# EAGLE design Printer Power (EAGLE 7.6.0)
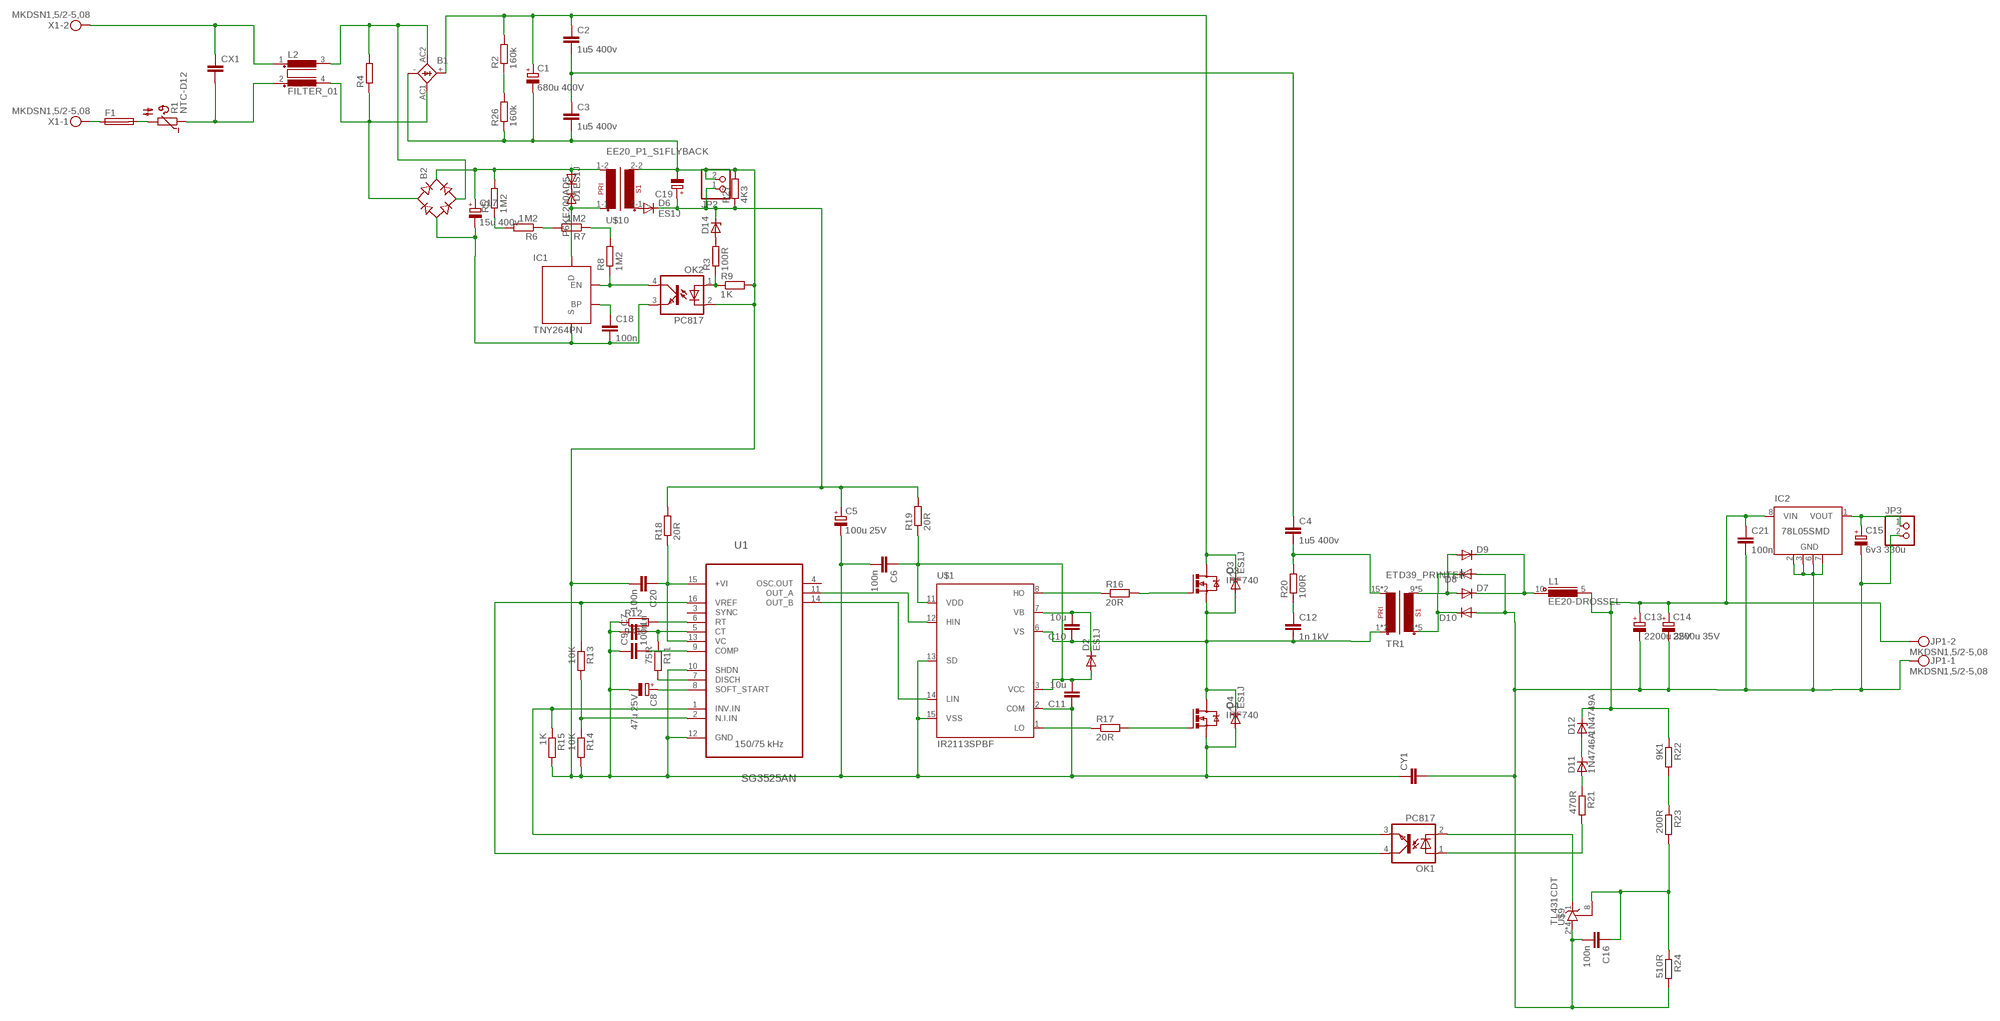
[diagram p0: schematic, sheet 1]

## Parts
B1  KBL  [KBL]
B2  RB1A  [RB1A]
C1  680u 400V  CPOL-EUE10-35  [EB35D]
C2  1u5 400v  C-EU225-074X268  [C225-074X268]
C3  1u5 400v  C-EU225-074X268  [C225-074X268]
C4  1u5 400v  C-EU225-074X268  [C225-074X268]
C5  100u 25V  CPOL-EUE2.5-7  [E2,5-7]
C6  100n  C-EUC0805  [C0805]
C7  1n  C-EUC0805  [C0805]
C8  47u 25V  CPOL-EUE2.5-7  [E2,5-7]
C9  100n  C-EUC0805  [C0805]
C10  10u  C-EUC0805  [C0805]
C11  10u  C-EUC0805  [C0805]
C12  1n 1kV  C-EU050-025X075  [C050-025X075]
C13  2200u 35V  CPOL-EUE7.5-18  [E7,5-18]
C14  2200u 35V  CPOL-EUE7.5-18  [E7,5-18]
C15  6v3 330u  CPOL-EUE2.5-7  [E2,5-7]
C16  100n  C-EUC0805  [C0805]
C17  15u 400v  CPOL-EUE5-13  [E5-13]
C18  100n  C-EUC0805  [C0805]
C19  CPOL-EUE2.5-7  [E2,5-7]
C20  100n  C-EUC0805  [C0805]
C21  100n  C-EUC0805  [C0805]
CX1  CXXC15B8  [XC15B8]
CY1  CYYC10B4  [YC10B4]
D1  P6KE200A  DIODE-DO204-10  [DO204-10]
D2  ES1J  DIODE-DO214AC  [DO214AC]
D3  ES1J  DIODE-DO214AC  [DO214AC]
D4  ES1J  DIODE-DO214AC  [DO214AC]
D5  ES1J  DIODE-DO214AC  [DO214AC]
D6  ES1J  DIODE-DO214AC  [DO214AC]
D7  DIODE-DO220S  [DO220S]
D8  DIODE-DO220S  [DO220S]
D9  DIODE-DO220S  [DO220S]
D10  DIODE-DO220S  [DO220S]
D11  1N4746A  ZENER-DIODEDO41Z10  [DO41Z10]
D12  1N4749A  ZENER-DIODEDO41Z10  [DO41Z10]
D14  ZENER-DIODEDO41Z10  [DO41Z10]
F1  SH22,5  [SH22,5]
IC1  TNY264PN  [DIP-8B]
IC2  78L05SMD  [SO08]
JP1  MKDSN1,5/2-5,08  [MKDSN1,5/2-5,08]
JP2  PINHD-1X2  [1X02]
JP3  PINHD-1X2  [1X02]
L1  EE20-DROSSEL  [EE20_DROSSEL]
L2  FILTER_01  [82721K]
OK1  PC817  [DIL04]
OK2  PC817  [DIL04]
Q3  IRF740  [TO220BV]
Q4  IRF740  [TO220BV]
R1  NTC-D12  [NTC-D12]
R2  160k  R-EU_0207/10  [0207/10]
R3  100R  R-EU_R0805  [R0805]
R4  R-EU_0309/10  [0309/10]
R5  1M2  R-EU_R0805  [R0805]
R6  1M2  R-EU_R0805  [R0805]
R7  1M2  R-EU_R0805  [R0805]
R8  1M2  R-EU_R0805  [R0805]
R9  1K  R-EU_R0805  [R0805]
R11  75R  R-EU_R0805  [R0805]
R12  9K1  R-EU_R0805  [R0805]
R13  10K  R-EU_R0805  [R0805]
R14  10K  R-EU_R0805  [R0805]
R15  1K  R-EU_R0805  [R0805]
R16  20R  R-EU_0309/12  [0309/12]
R17  20R  R-EU_0309/12  [0309/12]
R18  20R  R-EU_R2512  [R2512]
R19  20R  R-EU_R2512  [R2512]
R20  100R  R-EU_0617/17  [0617/17]
R21  470R  R-EU_R0805  [R0805]
R22  9K1  R-EU_R0805  [R0805]
R23  200R  R-EU_R0805  [R0805]
R24  510R  R-EU_R0805  [R0805]
R26  160k  R-EU_0207/10  [0207/10]
R27  4K3  R-EU_R0805  [R0805]
TR1  ETD39_PRINTER  [ETD39_16PIN]
U1  SG3525AN  [DIP254P762X510-16]
U$1  IR2113SPBF  [SO16W]
U$9  TL431CDT  [SO8]
U$10  EE20_P1_S1FLYBACK  [EE20_P1_S1-REV-4PIN]
X1  MKDSN1,5/2-5,08  [MKDSN1,5/2-5,08]

## Nets
HV-0: B1.- C1.- C3.2 C5.- C6.2 C7.1 C8.- C9.1 C11.1 C19.- C20.2 CY1.1 D4.A JP2.2 OK2.2(C) Q4.S R9.2 R12.1 R14.2 R15.2 R26.1 R27.2 U1.10(SHDN) U1.12(GND) U$1.2(COM) U$1.13(SD) U$1.15(VSS) U$10.2-2(S1-2)
HV-150: C2.2 C3.1 C4.1
HV-300: B1.+ C1.+ C2.1 D3.C Q3.D R2.2
N$1: F1.1 X1.1
N$2: F1.2 R1.2
N$3: CX1.2 L2.2 R1.1
N$4: D7.C D9.C L1.10
N$5: R16.1 U$1.8(HO)
N$6: R17.1 U$1.1(LO)
N$7: Q3.G R16.2
N$8: OK1.3(EMIT) R15.1 U1.1(INV.IN)
N$9: C4.2 R20.2 TR1.15(P1-2) TR1.16(P1-2)
N$10: C20.1 R18.1 U1.13(VC) U1.15(+VI)
N$11: B1.AC1(AC2) B2.AC1 L2.4 R4.1
N$12: CX1.1 L2.1 X1.2
N$13: B2.- C17.- C18.2 IC1.2(S) IC1.3(S) IC1.7(S) IC1.8(S) OK2.3(EMIT)
N$14: B1.AC2(AC1) B2.AC2 L2.3 R4.2
N$15: C7.2 R11.1 U1.5(CT)
N$16: R11.2 U1.7(DISCH)
N$17: Q4.G R17.2
N$18: U1.11(OUT_A) U$1.12(HIN)
N$19: U1.14(OUT_B) U$1.14(LIN)
N$20: R12.2 U1.6(RT)
N$21: C8.+ U1.8(SOFT_START)
N$22: C9.2 U1.9(COMP)
N$23: OK1.4(COL) R13.1 U1.16(VREF)
N$24: R13.2 R14.1 U1.2(N.I.IN)
N$25: IC1.4(EN) OK2.4(COL) R8.1
N$26: C13.- C14.- C15.- C16.2 C21.2 CY1.2 D8.A D10.A IC2.2(GND) IC2.3(GND) IC2.6(GND) IC2.7(GND) JP1.1 JP3.2 R24.2 U$9.2(A) U$9.3(A) U$9.6(A) U$9.7(A)
N$27: D8.C D10.C TR1.4(S1-1) TR1.5(S1-1) TR1.6(S1-1) TR1.7(S1-1) TR1.8(S1-1)
N$28: R5.1 R6.2
N$29: R6.1 R7.2
N$30: C12.1 R20.1
N$31: D7.A D9.A TR1.9(S1-2) TR1.10(S1-2) TR1.11(S1-2) TR1.12(S1-2) TR1.13(S1-2)
N$32: C15.+ IC2.1(VOUT) JP3.1
N$36: C13.+ C14.+ C21.1 D12.C IC2.8(VIN) JP1.2 L1.5 R22.1
N$37: D11.C D12.A
N$38: D11.A R21.1
N$39: OK1.1(A) R21.2
N$40: OK1.2(C) U$9.1(C)
N$41: C16.1 R23.2 R24.1 U$9.8(R)
N$42: R22.2 R23.1
N$44: R2.1 R26.2
N$46: C5.+ C19.+ D6.C D14.C JP2.1 R18.2 R19.2 R27.1
N$47: R7.1 R8.2
N$48: D1.C D5.C
N$49: D5.A IC1.5(D) U$10.1-1
N$50: D14.A R3.2
N$51: C18.1 IC1.1(BP)
N$52: B2.+ C17.+ D1.A R5.2 U$10.1-2
N$53: D6.A U$10.2-1(S1-1)
N$54: OK2.1(A) R3.1 R9.1
VB: C10.2 D2.C U$1.7(VB)
VCC: C6.1 C11.2 D2.A R19.1 U$1.3(VCC) U$1.11(VDD)
VS: C10.1 C12.2 D3.A D4.C Q3.S Q4.D TR1.1(P1-1) TR1.2(P1-1) U$1.6(VS)
Unconnected: IC2.4(NC) IC2.5(NC) U1.3(SYNC) U1.4(OSC.OUT)

## Notes on the sheet
- 150/75 kHz

## Library data of the parts
B1 = rectifier:KBL: DIOTEC RECTIFIER
B2 = rectifier:RB1A: RECTIFIER 1 A
C1 C5 C8 C13-C15 C17 C19 = rcl:CPOL-EU: POLARIZED CAPACITOR, European symbol
C2-C4 C6 C7 C9-C12 C16 C18 C20 C21 = rcl:C-EU: CAPACITOR, European symbol
CX1 = rcl:CX: X CAPACITOR for power line
CY1 = rcl:CY: Y CAPACITOR for power line
D1-D10 = diode:DIODE-: DIODE
D11 D12 D14 = diode:ZENER-DIODE: Z-Diode
F1 = fuse:SH22,5: FUSE HOLDER grid 22,5 mm, OGN0031 8201, Schurter (Buerklin); MF: SCHURTER; MPN: 0031.8201; OC_FARNELL: 1162740; OC_NEWARK: 96F8317
IC1 = Namenlos:TNY264PN
IC2 = linear:78L*SMD: Positive VOLTAGE REGULATOR
JP1 X1 = con-phoenix-508:MKDSN1,5/2-5,08: MKDSN 1,5/ 2-5,08 Printklemme Nennstrom: 13,5 A Nennspannung: 250 V Rastermaß: 5,08 mm Polzahl: 2 Anschlussart: Schraubanschluss Montage: Löten Anschlussrichtung Leiter/Platine: 0 ° Artikelnummer: 1729128 Source: http://eshop.phoenixcontact.com .. 1729128.pdf
JP2 JP3 = pinhead:PINHD-1X2: PIN HEADER
L1 = _Transformers:EE20-DROSSEL
L2 = _Transformers:FILTER_01
OK1 OK2 = optocoupler:PC817: SHARP OPTO COUPLER; MPN: PC817X4J000F; OC_FARNELL: 9707727; OC_NEWARK: 97K7059
Q3 Q4 = transistor-power:IRF740: N-CHANNEL MOS FET
R1 = Namenlos:NTC-D12
R2-R9 R11-R24 R26 R27 = rcl:R-EU_: RESISTOR, European symbol
TR1 = _Transformers:ETD39_PRINTER
U1 = ST Microelctronics_By_element14_Batch_1:SG3525AN: REGULATING PULSE WIDTH MODULATORS; MPN: SG3525AN; OC_FARNELL: 1564368; OC_NEWARK: 89K1506; PACKAGE: PDIP-16; SUPPLIER: STMICROELECTRONICS
U$1 = Namenlos:IR2113SPBF
U$9 = Namenlos:TL431
U$10 = _Transformers:EE20_P1_S1

## Net classes
0 default: clearance 0.205 mm

## Board
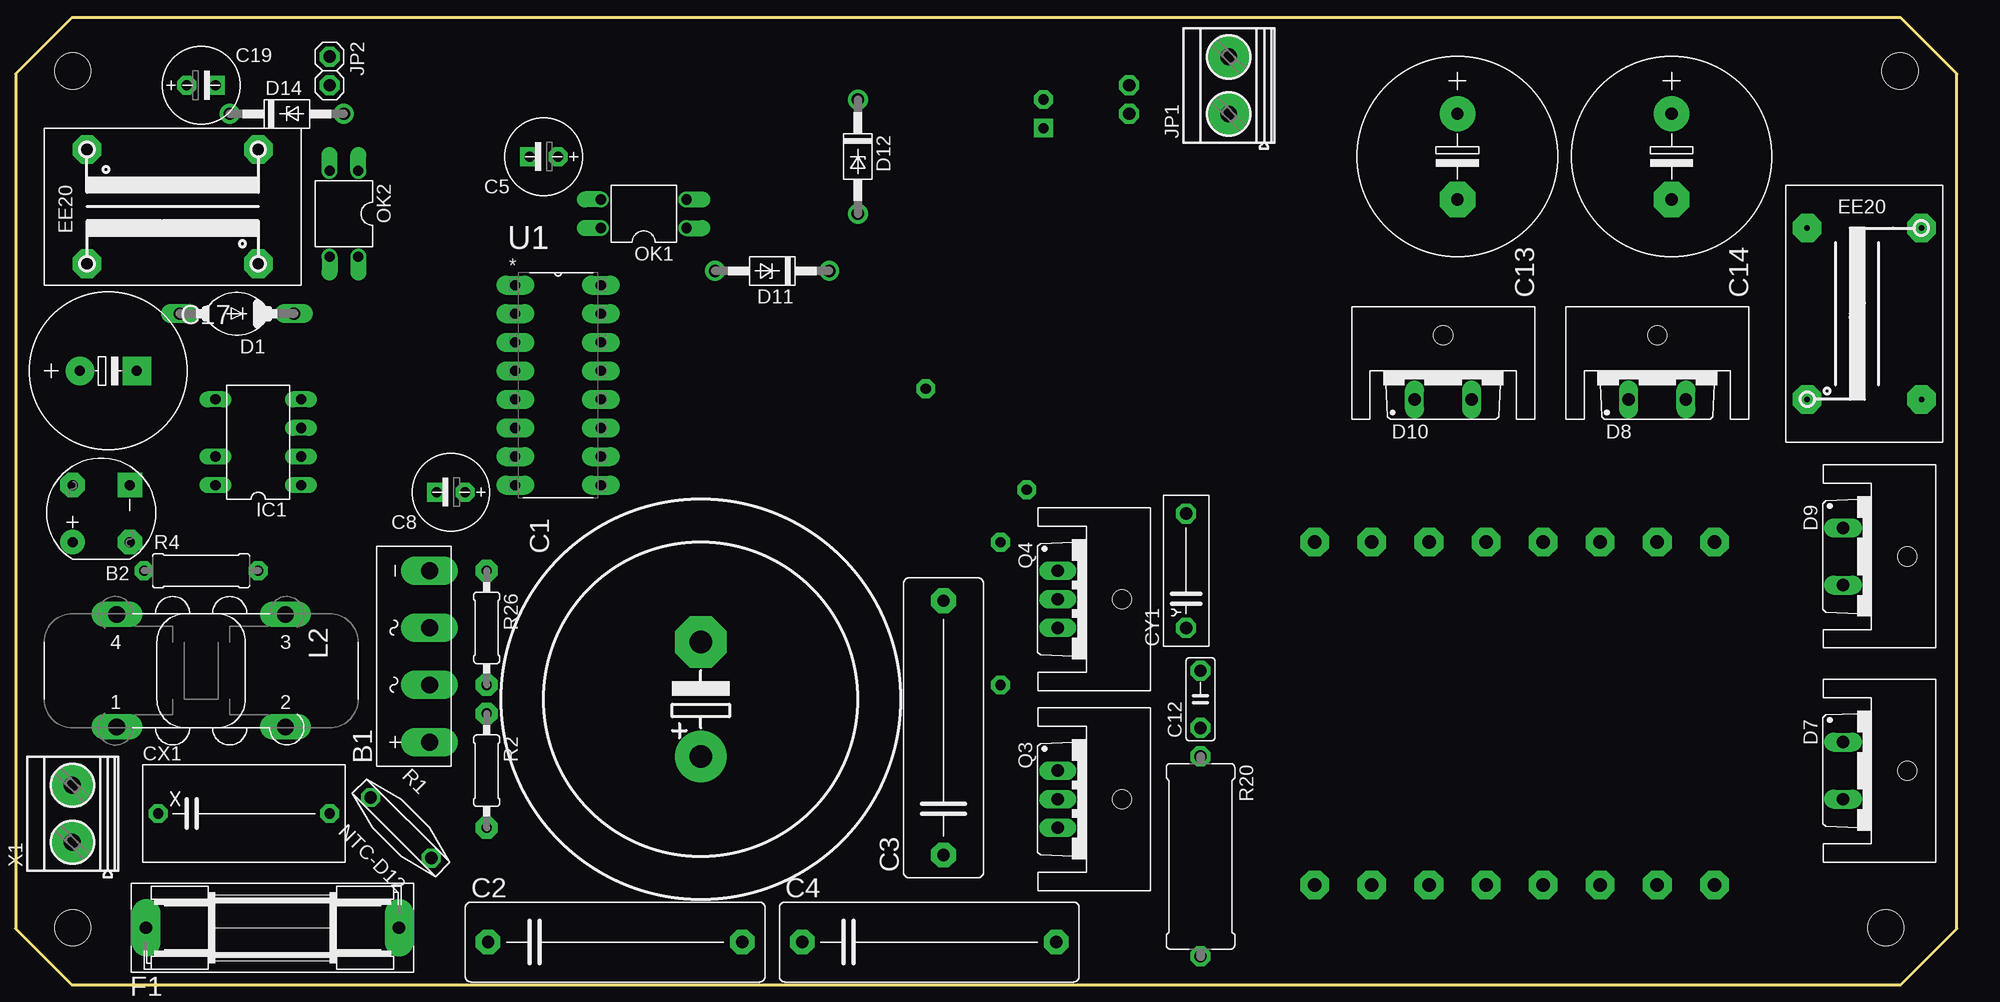
[diagram p1: board, top side]
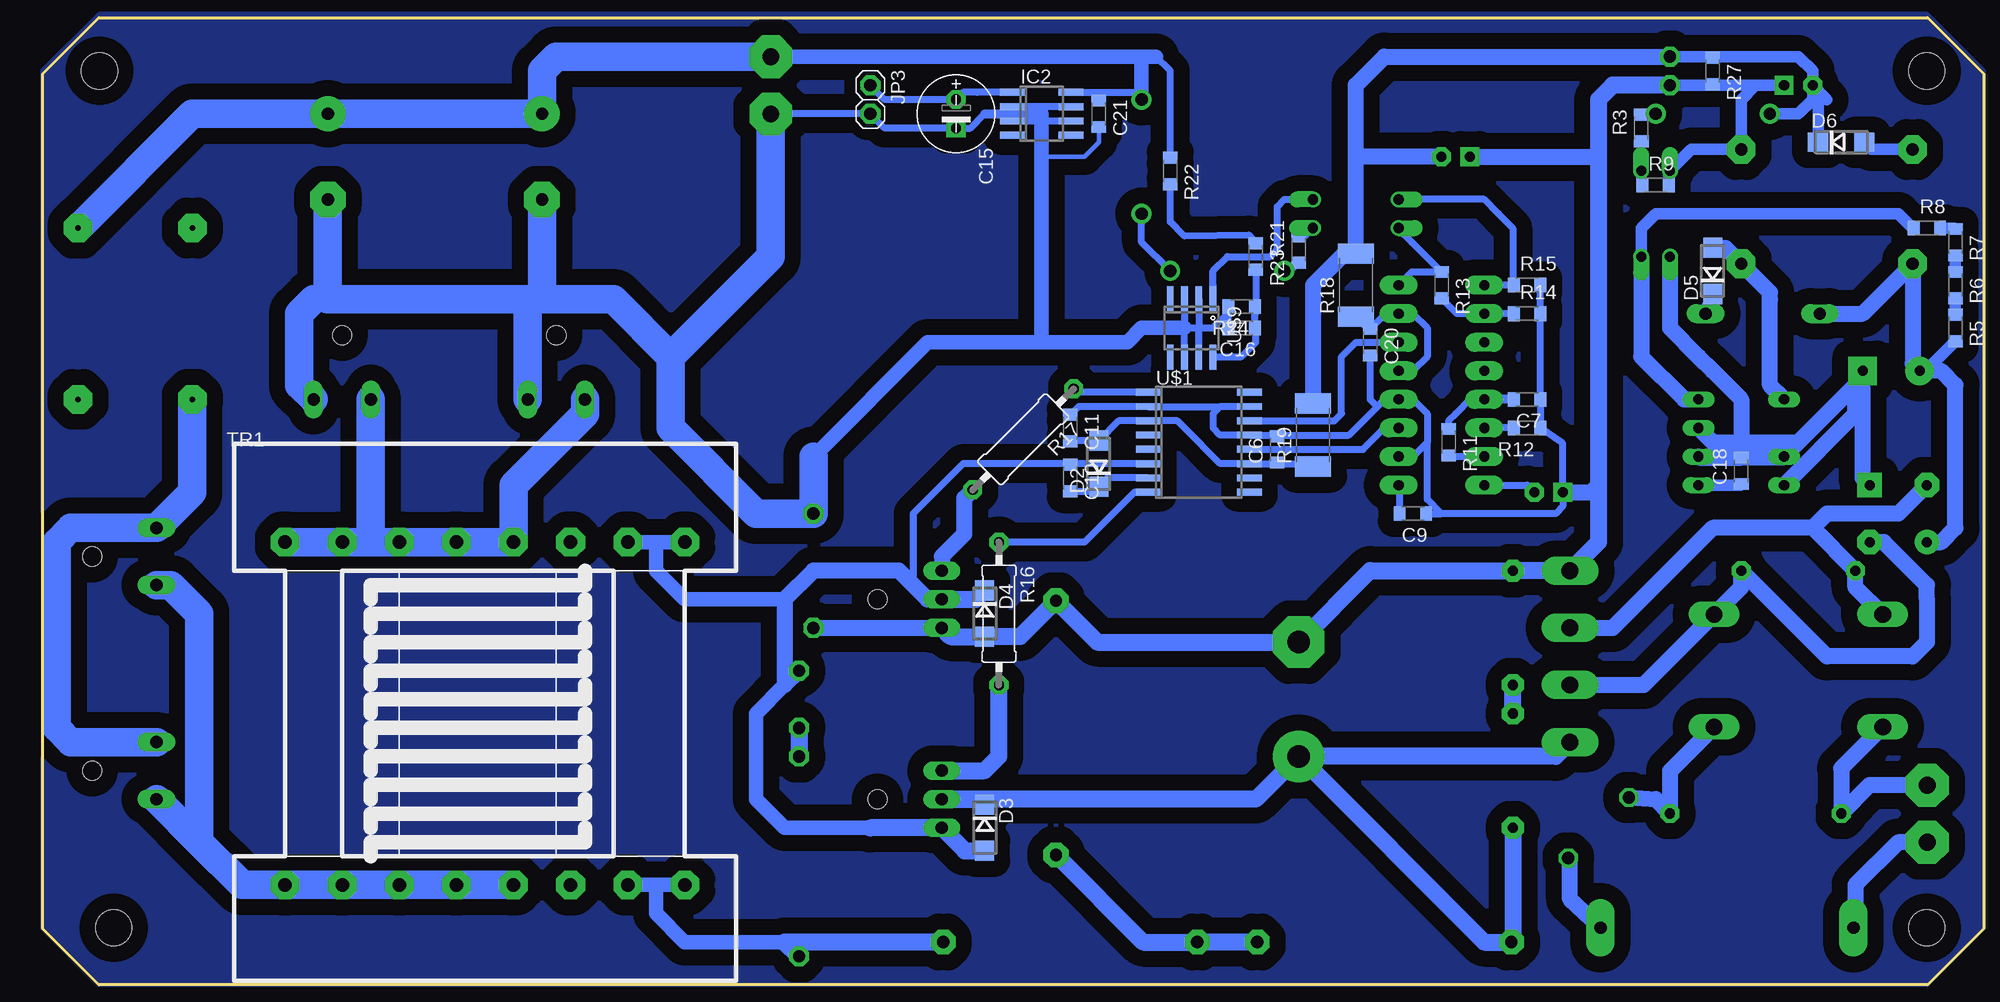
[diagram p2: board, bottom side, seen from below]

No outline drawn. Coordinates in mm, seen from the top.
Copper layers (1*16): Top 0.035mm / dielectric 1.5mm / Bottom 0.035mm
Design rules "default": minimum track width 10mil, minimum drill 24mil, track to track 8mil, track to pad 8mil, pad to pad 8mil, via to via 8mil, smd to smd 8mil, copper to edge 40mil, drill to drill 8mil, minimum pad ring 10mil, minimum via ring 8mil, stop-mask expansion 4mil, vias tented up to drill 0mil, thermal gap 10mil
Holes 3.2 mm at 167.64,81.28 166.37,5.08 5.08,5.08 5.08,81.28
Milling: 8 lines

### Footprints (pad centres in the part's own frame; a part is rotated, then mirrored left to right if it is on the bottom)
KBL = drill 1.5 pad 2.54 long: + -7.62,-1.27; - 7.62,-1.27; AC1 2.54,-1.27; AC2 -2.54,-1.27
RB1A = drill 0.9 pad 2.184: + -2.54,2.54 | drill 0.9 pad 2.184 square: - 2.54,-2.54 | drill 0.9 pad 2.184 octagon: AC1 2.54,2.54; AC2 -2.54,-2.54
EB35D = drill 2.007 pad 4.597: + -5.08,0 | drill 2.007 pad 4.597 octagon: - 5.08,0
C225-074X268 = drill 1.1 pad 2.184 octagon: 1 -11.303,0; 2 11.303,0
E2,5-7 = drill 0.9 pad 1.676 octagon: + -1.27,0 | drill 0.9 pad 1.676 square: - 1.27,0
C0805 = smd 1.05 x 1.3: 1 -1.175,0; 2 1.175,0
C050-025X075 = drill 1.1 pad 1.778 octagon: 1 -2.54,0; 2 2.54,0
E7,5-18 = drill 1.1 pad 3.15: + -3.81,0 | drill 1.1 pad 3.15 octagon: - 3.81,0
E5-13 = drill 0.9 pad 2.54: + -2.54,0 | drill 0.9 pad 2.54 square: - 2.54,0
XC15B8 = drill 0.9 pad 1.676 octagon: 1 -7.62,0; 2 7.62,0
YC10B4 = drill 1.1 pad 1.778 octagon: 1 -5.08,0; 2 5.08,0
DO204-10 = drill 1.1 pad 1.676 long: A 5.08,0; C -5.08,0
DO214AC = smd 1.8 x 1.7: A 2.05,0; C -2.05,0
DO220S = drill 1.1 pad 1.676 long: A 2.54,-2.54; C -2.54,-2.54
DO41Z10 = drill 1.1 pad 1.778: A 5.08,0; C -5.08,0
SH22,5 = drill 1.1 pad 2.54 long: 1 -11.252,0; 2 11.252,0
DIP-8B = drill 0.9 long: 1 -3.81,-3.81; 2 -1.27,-3.81; 3 1.27,-3.81; 4 3.81,-3.81; 5 3.81,3.81; 7 -1.27,3.81; 8 -3.81,3.81
SO08 = smd 0.6 x 2.2: 1 -1.905,-2.6; 2 -0.635,-2.6; 3 0.635,-2.6; 4 1.905,-2.6; 5 1.905,2.6; 6 0.635,2.6; 7 -0.635,2.6; 8 -1.905,2.6
MKDSN1,5/2-5,08 = drill 1.5 pad 3.81 octagon: 1 -2.561,0.025; 2 2.519,0.025
1X02 = drill 1.1 pad 1.778 octagon: 1 -1.27,0; 2 1.27,0
EE20_DROSSEL = drill 0.5 pad 2.54 octagon: 1 -7.62,-5.715; 5 7.62,-5.715; 6 7.62,4.445; 10 -7.62,4.445
82721K = drill 1.5 long: 1 7.493,5.004; 2 -7.493,5.004; 3 -7.493,-5.004; 4 7.493,-5.004
DIL04 = drill 0.9 pad 1.27 offset: 1 -1.27,-3.81; 2 1.27,-3.81; 3 1.27,3.81; 4 -1.27,3.81
TO220BV = drill 1.1 pad 1.422 long: D 0,-2.54; G -2.54,-2.54; S 2.54,-2.54
NTC-D12 = drill 1.1 pad 1.676 octagon: 1 -3.81,0; 2 3.81,0
0207/10 = drill 0.9 pad 1.93 octagon: 1 -5.08,0; 2 5.08,0
R0805 = smd 1.05 x 1.3: 1 -1.175,0; 2 1.175,0
0309/10 = drill 0.9 pad 1.676 octagon: 1 -5.08,0; 2 5.08,0
0309/12 = drill 0.9 pad 1.676 octagon: 1 -6.35,0; 2 6.35,0
R2512 = smd 1.8 x 3.2: 1 -2.8,0; 2 2.8,0
0617/17 = drill 1.1 pad 1.778 octagon: 1 -8.89,0; 2 8.89,0
ETD39_16PIN = drill 1.2 pad 2.54 octagon: 1 17.78,15.24; 2 12.7,15.24; 3 7.62,15.24; 4 2.54,15.24; 5 -2.54,15.24; 6 -7.62,15.24; 7 -12.7,15.24; 8 -17.78,15.24; 9 -17.78,-15.24; 10 -12.7,-15.24; 11 -7.62,-15.24; 12 -2.54,-15.24; 13 2.54,-15.24; 14 7.62,-15.24; 15 12.7,-15.24; 16 17.78,-15.24
DIP254P762X510-16 = drill 0.9 pad 1.676 long: 1 -3.81,8.89; 2 -3.81,6.35; 3 -3.81,3.81; 4 -3.81,1.27; 5 -3.81,-1.27; 6 -3.81,-3.81; 7 -3.81,-6.35; 8 -3.81,-8.89; 9 3.81,-8.89; 10 3.81,-6.35; 11 3.81,-3.81; 12 3.81,-1.27; 13 3.81,1.27; 14 3.81,3.81; 15 3.81,6.35; 16 3.81,8.89
SO16W = smd 0.6 x 2.2: 1 -4.445,-4.505; 2 -3.175,-4.505; 3 -1.905,-4.505; 4 -0.635,-4.505; 5 0.635,-4.505; 6 1.905,-4.505; 7 3.175,-4.505; 8 4.445,-4.505; 9 4.445,4.505; 10 3.175,4.505; 11 1.905,4.505; 12 0.635,4.505; 13 -0.635,4.505; 14 -1.905,4.505; 15 -3.175,4.505; 16 -4.445,4.505
SK95-3M3_HOLE = hole 1.7: 0,3.175
SO8 = smd 0.6 x 2.2: 1 -1.905,-2.6; 2 -0.635,-2.6; 3 0.635,-2.6; 4 1.905,-2.6; 5 1.905,2.6; 6 0.635,2.6; 7 -0.635,2.6; 8 -1.905,2.6
EE20_P1_S1-REV-4PIN = drill 1.1 pad 2.54 octagon: 1-1 -7.62,5.715; 1-2 7.62,5.715; 2-1 7.62,-4.445; 2-2 -7.62,-4.445

### Placement (x,y rotation side)
B1  35.56,29.21 90 top
B2  7.62,41.91 90 top
C1  60.96,25.4 90 top
C2  53.34,3.81 0 top
C3  82.55,22.86 90 top
C4  81.28,3.81 0 top
C5  46.99,73.66 180 top
C6  62.87,47.62 90 bottom
C7  40.64,52.07 180 bottom
C8  38.73,43.81 180 top
C9  50.8,41.91 180 bottom
C10  81.28,45.09 270 bottom
C11  81.28,49.53 270 bottom
C12  105.41,25.4 90 top
C13  128.27,73.66 270 top
C14  147.32,73.66 270 top
C15  91.44,77.47 270 bottom
C16  66.04,58.42 180 bottom
C17  8.26,54.61 0 top
C18  21.59,45.72 90 bottom
C19  16.51,80.01 0 top
C20  54.61,57.15 270 bottom
C21  78.74,77.47 270 bottom
CX1  20.32,15.24 0 top
CY1  104.14,36.83 90 top
D1  19.68,59.69 180 top
D2  78.74,46.35 90 bottom
D3  88.9,13.97 270 bottom
D4  88.9,33.02 270 bottom
D5  24.13,63.5 90 bottom
D6  12.7,74.93 0 bottom
D7  165.1,19.05 270 top
D8  146.05,54.61 0 top
D9  165.1,38.1 270 top
D10  127,54.61 0 top
D11  67.31,63.5 180 top
D12  74.93,73.66 270 top
D14  24.13,77.47 0 top
F1  22.86,5.08 0 top
IC1  21.59,48.26 90 top
IC2  83.82,77.47 270 bottom
JP1  107.95,80.01 90 top
JP2  27.94,81.28 270 top
JP3  99.06,78.74 270 bottom
L1  163.83,59.69 90 top
L2  16.51,27.94 180 top
OK1  55.88,68.58 90 top
OK2  29.21,68.58 180 top
Q3  95.25,16.51 270 top
Q4  95.25,34.29 270 top
R1  34.29,13.97 315 top
R2  41.91,19.05 270 top
R3  30.48,76.2 90 bottom
R4  16.51,36.83 0 top
R5  2.54,58.42 270 bottom
R6  2.54,62.23 270 bottom
R7  2.54,66.04 270 bottom
R8  5.08,67.31 0 bottom
R9  29.21,71.12 0 bottom
R11  47.62,48.26 270 bottom
R12  40.64,49.53 180 bottom
R13  48.26,62.23 270 bottom
R14  40.64,59.69 0 bottom
R15  40.64,62.23 0 bottom
R16  87.63,33.02 270 bottom
R17  85.46,48.52 225 bottom
R18  55.88,62.23 90 bottom
R19  59.69,48.9 90 bottom
R20  105.41,11.43 270 top
R21  60.96,65.41 90 bottom
R22  72.39,72.39 270 bottom
R23  64.77,64.77 270 bottom
R24  66.04,60.33 180 bottom
R26  41.91,31.75 270 top
R27  24.13,81.28 270 bottom
TR1  133.35,24.13 0 bottom
U1  48.26,53.34 0 top
U$1  69.85,48.26 270 bottom
U$3  [SK95-3M3_HOLE]  95.25,16.51 270 top
U$4  [SK95-3M3_HOLE]  95.25,34.29 270 top
U$5  [SK95-3M3_HOLE]  146.05,54.61 0 top
U$6  [SK95-3M3_HOLE]  127,54.61 0 top
U$7  [SK95-3M3_HOLE]  165.1,19.05 270 top
U$8  [SK95-3M3_HOLE]  165.1,38.1 270 top
U$9  70.48,58.42 180 bottom
U$10  13.97,69.85 180 top
X1  5.08,15.24 90 top

### Tracks (layer width: path | path; a pad name or v marks a point on that pad's centre or on a via)
HV-0
  Bottom 0.61: 49.53,48.26 49.53,50.8 50.8,52.07 U1.12 53.34,52.07 53.98,51.44 | 49.53,48.26 50.8,46.99 U1.10 | 48.26,41.91 38.1,41.91 37.47,42.55 C8.- 37.47,48.16 R12.1 C7.1 R14.2 R15.2 | 48.26,41.91 49.53,43.18 49.53,48.26 | C11.1 80.55,51.44 U$1.2 67.94,51.44 | C20.2 54.61,52.07 53.98,51.44 | 63.5,48.9 U$1.13 67.94,48.9 68.58,49.53 68.58,50.8 67.94,51.44 | 63.5,48.9 56.52,48.9 53.98,51.44 | U$1.15 67.31,51.44 67.94,51.44 | C6.2 63.41,48.8 63.5,48.9 | C9.1 48.26,41.91 | R27.2 24.13,80.01
  Bottom 1.016: R9.2 28.04,72.3 OK2.2 26.04,74.3 U$10.2-2 21.59,78.74 20.32,80.01 C19.- 24.13,80.01 JP2.2
  Bottom 1.422: C8.- 34.92,43.81 34.29,44.45 | C5.- 34.29,73.66 | CY1.1 Q4.S
  Bottom 1.524: Q4.S 91.93,30.97 D4.A 85.74,30.97 C3.2 78.87,30.48 C1.- 54.61,36.83 R26.1 B1.- 34.29,39.37 34.29,44.45 34.29,73.66 34.29,78.74 33.02,80.01 JP2.2
HV-150
  Bottom 1.524: C2.2 C4.1 74.8,3.81 C3.1
HV-300
  Bottom 1.524: B1.+ 38.1,20.32 C1.+ | C1.+ 44.45,3.81 C2.1 41.91,3.94 R2.2 | 89.39,16.51 Q3.D 89.39,16.51 | 89.39,16.51 D3.C | C1.+ 64.77,16.51 89.39,16.51
N$1
  Bottom 1.422: X1.1 7.64,12.68 11.43,8.89 11.43,5.26 F1.1
N$2
  Bottom 1.422: F1.2 34.29,5.26 36.83,7.62 36.83,11.28 R1.2
N$3
  Bottom 1.422: R1.1 29.21,16.51 CX1.2 27.94,19 L2.2
N$4
  Bottom 2.54: D7.C 170.18,21.59 171.45,22.86 171.45,39.37 170.18,40.64 D9.C 159.38,43.81 L1.10
N$5
  Bottom 0.61: U$1.8 75.56,43.81 80.01,39.37 R16.1
N$6
  Bottom 0.61: U$1.1 80.54,52.7 R17.1
N$7
  Bottom 1.524: Q3.G 88.9,19.05 87.63,20.32 R16.2
N$8
  Bottom 0.61: U1.1 R15.1 41.91,62.33 41.91,67.31 43.18,68.58 44.45,69.85 OK1.3
N$9
  Bottom 1.27: TR1.16 TR1.15 118.11,8.89 118.11,6.35 115.57,3.81 106.68,3.81
  Bottom 1.524: C4.2 106.68,3.81 R20.2
N$10
  Bottom 0.61: U1.13 50.8,54.61 49.53,55.88 49.53,58.42 50.8,59.69 U1.15 53.24,59.69 C20.1 54.77,58.33 R18.1
N$11
  Bottom 1.422: L2.4 11.43,35.36 R4.1 15.24,40.64 | B1.AC1 33.02,31.75 24.13,40.64 15.24,40.64 | B2.AC1 7.62,41.91 13.97,41.91 15.24,40.64
N$12
  Bottom 1.422: X1.2 10.18,17.76 CX1.1 12.7,19.25 L2.1
N$13
  Bottom 1.422: B2.- 10.79,45.09 C17.- 10.79,53.98 11.43,53.34 | 16.51,48.26 IC1.7 17.88,46.9 C18.2 25.3,46.9 IC1.2 | IC1.3 24.13,48.26 21.59,48.26 | 16.51,48.26 11.43,53.34 | IC1.8 11.43,50.8 11.43,53.34 | 21.59,48.26 16.51,48.26 | OK2.3 27.94,58.42 25.4,55.88 24.13,54.61 21.59,52.07 21.59,48.26
N$14
  Bottom 1.422: B1.AC2 30.28,26.67 L2.3 21.59,35.36 R4.2 13.97,29.21 6.35,29.21 5.08,30.48 5.08,34.29 5.08,35.56 8.89,39.37 B2.AC2
N$15
  Bottom 0.61: U1.5 45.72,52.07 46.99,50.8 47.62,50.16 R11.1
  Bottom 0.813: C7.2 U1.5
N$16
  Bottom 0.61: U1.7 47.53,46.99 R11.2
N$17
  Bottom 1.422: Q4.G 92.71,38.1 90.7,40.11 90.7,43.29 R17.2
N$18
  Bottom 0.61: U$1.12 55.24,47.62 53.34,49.53 U1.11
N$19
  Bottom 0.61: U$1.14 62.87,50.16 57.78,50.16 57.15,50.8 57.15,55.88 55.88,57.15 U1.14
N$20
  Bottom 0.61: R12.2 U1.6
N$21
  Bottom 0.61: U1.8 40.64,44.45 C8.+
N$22
  Bottom 0.61: C9.2 51.98,44.35 U1.9
N$23
  Bottom 0.61: U1.16 50.9,63.41 R13.1 50.9,66.04 52.07,67.22 OK1.4
N$24
  Bottom 0.61: R14.1 U1.2 46.9,59.69 R13.2
N$25
  Bottom 1.016: R8.1 6.35,67.31 7.62,68.58 29.21,68.58 30.48,67.31 OK2.4
  Bottom 1.422: OK2.4 30.48,55.88 26.67,52.07 IC1.4
N$26
  Bottom 0.406: IC2.2 86.42,77.53 86.36,77.47 | C21.2 78.74,74.93 80.01,73.66 83.82,73.66
  Bottom 0.61: U$9.3 71.12,58.42 | 71.12,58.42 69.85,58.42 | U$9.2 69.85,58.42 | U$9.7 69.85,58.42 | U$9.6 71.12,58.42 | 69.85,58.42 68.58,58.42 67.31,59.69 | 67.31,59.69 67.31,60.23 R24.2 | C16.2 67.22,59.59 67.31,59.69 | IC2.7 IC2.2 | IC2.3 83.82,76.83 IC2.6 | 88.9,77.47 90.17,76.2 C15.- 97.79,76.2 JP3.2 107.9,77.47 JP1.1
  Bottom 0.813: 88.9,77.47 86.48,77.47 86.42,77.53
  Bottom 1.27: D10.A 129.54,53.34 | 128.27,60.96 129.54,60.96 | 148.59,60.96 147.32,60.96 | 104.14,46.99 93.98,57.15 83.82,57.15 | 83.82,57.15 76.2,57.15 74.93,58.42 71.12,58.42 | 83.82,76.83 83.82,73.66 83.82,57.15 | 83.82,76.83 83.82,77.47 | 83.82,77.47 83.82,76.83 | 86.36,77.47 83.82,77.47
  Bottom 2.54: 148.59,60.96 149.86,59.69 149.86,53.34 D8.A | D10.A 129.54,60.96 147.32,60.96 C14.- | C13.- 128.27,60.96 127,60.96 121.92,60.96 116.84,55.88 | 104.14,46.99 CY1.2 109.22,41.91 116.84,49.53 116.84,55.88 | 107.95,77.47 107.95,64.77 116.84,55.88
N$27
  Bottom 2.54: D10.C 124.46,50.8 130.81,44.45 TR1.4 133.35,39.37 TR1.5 TR1.6 143.51,39.37 | 143.51,39.37 TR1.7 TR1.8 | D8.C 143.51,39.37
N$28
  Bottom 1.016: R5.1 R6.2
N$29
  Bottom 1.016: R6.1 R7.2
N$30
  Bottom 1.524: C12.1 R20.1
N$31
  Bottom 2.54: 158.75,12.7 154.94,8.89 TR1.9 TR1.10 TR1.11 TR1.12 TR1.13 | 158.75,12.7 D7.A | D9.A 161.29,35.56 158.75,33.02 158.75,12.7
N$32
  Bottom 0.61: IC2.1 89.53,79.38 90.81,79.38 C15.+ 97.79,78.74 JP3.1
N$36
  Bottom 0.406: C21.1 78.74,79.38
  Bottom 0.61: R22.1 72.39,75.03 72.39,81.28 73.64,82.53 73.66,82.55 | IC2.8 78.74,79.38 75.56,79.38 D12.C
  Bottom 1.27: 73.66,82.55 73.97,82.55 | 73.97,82.55 73.66,82.55 | 73.66,82.55 73.97,82.55 | 73.97,82.55 73.66,82.55 | 128.27,78.74 129.54,77.47 | 73.64,82.53 73.66,82.55 | 73.66,82.55 73.97,82.55 | 73.97,82.55 74.93,82.55 | 74.93,82.55 107.95,82.55 JP1.2 | D12.C 74.93,82.55
  Bottom 2.54: L1.5 159.38,77.47 C14.+ 129.54,77.47 C13.+ | 107.95,82.55 127,82.55 128.27,81.28 128.27,78.74
N$37
  Bottom 0.61: D11.C 74.93,66.04 D12.A
N$38
  Bottom 0.61: R21.1 61.69,63.5 D11.A
N$39
  Bottom 0.61: OK1.1 60.42,66.58 R21.2
N$40
  Bottom 0.61: U$9.1 68.58,62.23 68.58,63.5 67.31,64.77 63.5,64.77 62.87,65.41 62.87,69.22 62.23,69.85 OK1.2
N$41
  Bottom 0.61: R23.2 64.77,59.69 | U$9.8 68.58,55.88 66.04,55.88 64.77,57.15 64.77,58.33 C16.1 64.86,59.59 64.77,59.69 | R24.1 64.86,59.78 64.77,59.69
N$42
  Bottom 0.61: R23.1 65.41,66.67 71.1,66.6 72.39,67.87 R22.2
N$44
  Bottom 1.524: R2.1 R26.2
N$46
  Bottom 0.61: R27.1 24.13,82.55
  Bottom 1.016: D14.C 16.51,77.47 15.24,78.74 | D6.C 14.75,78.25 15.24,78.74 | 15.24,78.74 C19.+ | 13.97,78.74 C19.+ | JP2.1 24.13,82.55 16.51,82.55 15.24,81.28 C19.+
  Bottom 1.422: R19.2 59.69,62.23 56.89,65.03 R18.2 55.88,73.66 | 55.88,73.66 55.88,80.01 53.34,82.55 JP2.1 | C5.+ 55.88,73.66
N$47
  Bottom 1.016: R7.1 2.63,67.31 R8.2
N$48
  Bottom 1.422: D5.C 24.13,60.96 D1.C
N$49
  Bottom 1.422: IC1.5 19.05,53.34 19.05,60.96 19.05,61.59 U$10.1-1 23,65.55 D5.A
N$50
  Bottom 0.406: R3.2 29.21,77.38 D14.A
N$51
  Bottom 1.016: C18.1 21.68,44.45 IC1.1
N$52
  Bottom 1.016: R5.2 5.17,54.61 C17.+
  Bottom 1.422: B2.+ 3.81,39.37 2.54,40.64 2.54,53.34 3.81,54.61 C17.+ 6.35,55.24 U$10.1-2 10.79,59.69 D1.A
N$53
  Bottom 1.016: U$10.2-1 10.02,74.3 D6.A
N$54
  Bottom 0.406: R3.1 OK2.1 30.48,71.12 R9.1
N$55
  pour Bottom (isolate 1.422): 0,81.28 5.08,86.36 167.64,86.36 172.72,81.28 172.72,5.08 167.64,0 5.08,0 0,5.08
VB
  Bottom 0.61: U$1.7 77.96,45.09 D2.C 79.14,43.91 C10.2
VCC
  Bottom 0.61: C11.2 81.23,48.41 D2.A 76.98,50.16 U$1.3 71.75,50.16 71.12,49.53 67.94,46.35 U$1.11 63.5,46.35 | 63.5,46.35 59.95,46.35 R19.1 | C6.1 63.41,46.45 63.5,46.35
VS
  Bottom 0.61: U$1.6 82.55,46.35 | 82.55,46.35 90.81,46.35 95.25,41.91 95.25,35.56 94.61,34.92 | C10.1 82.55,46.35
  Bottom 1.27: TR1.1 118.11,39.37 | 118.11,39.37 TR1.2 | 106.68,34.29 115.57,34.29 118.11,36.83 118.11,39.37 | 99.06,13.97 106.68,13.97 109.22,16.51 109.22,24.13 106.68,26.67
  Bottom 1.422: C12.2 106.68,26.67 106.68,34.29 104.14,36.83 96.52,36.83 94.61,34.92 93.98,34.29 Q4.D
  Bottom 1.524: D3.A 90.66,11.92 Q3.S 99.06,13.97 | Q4.D 89.68,34.29 D4.C